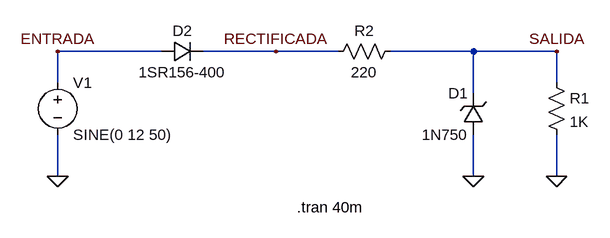
[diagram p0: schematic diodo-zener.asc]
diodo-zener.asc, the LTspice schematic file:
Version 4
SHEET 1 880 680
WIRE 128 80 -32 80
WIRE 304 80 192 80
WIRE 400 80 304 80
WIRE 608 80 480 80
WIRE 736 80 608 80
WIRE -32 128 -32 80
WIRE 736 128 736 80
WIRE 608 144 608 80
WIRE -32 272 -32 208
WIRE 608 272 608 208
WIRE 736 272 736 208
FLAG -32 272 0
FLAG 736 272 0
FLAG 736 80 SALIDA
FLAG -32 80 ENTRADA
FLAG 608 272 0
FLAG 304 80 RECTIFICADA
SYMBOL zener 624 208 R180
WINDOW 0 24 64 Left 2
WINDOW 3 24 0 Left 2
SYMATTR InstName D1
SYMATTR Value 1N750
SYMATTR Description Diode
SYMATTR Type diode
SYMBOL diode 128 96 R270
WINDOW 0 32 32 VTop 2
WINDOW 3 0 32 VBottom 2
SYMATTR InstName D2
SYMATTR Value 1SR156-400
SYMBOL voltage -32 112 R0
WINDOW 123 0 0 Left 0
WINDOW 39 0 0 Left 0
SYMATTR InstName V1
SYMATTR Value SINE(0 12 50)
SYMBOL res 720 112 R0
SYMATTR InstName R1
SYMATTR Value 1K
SYMBOL res 496 64 R90
WINDOW 0 0 56 VBottom 2
WINDOW 3 32 56 VTop 2
SYMATTR InstName R2
SYMATTR Value 220
TEXT 336 320 Left 2 !.tran 40m

The netlist it stands for:
* diodo-zener.asc
D1 0 SALIDA 1N750
D2 ENTRADA RECTIFICADA 1SR156-400
V1 ENTRADA 0 SINE(0 12 50)
R1 SALIDA 0 1K
R2 SALIDA RECTIFICADA 220
.model D D
.lib standard.dio
.tran 40m
.backanno
.end